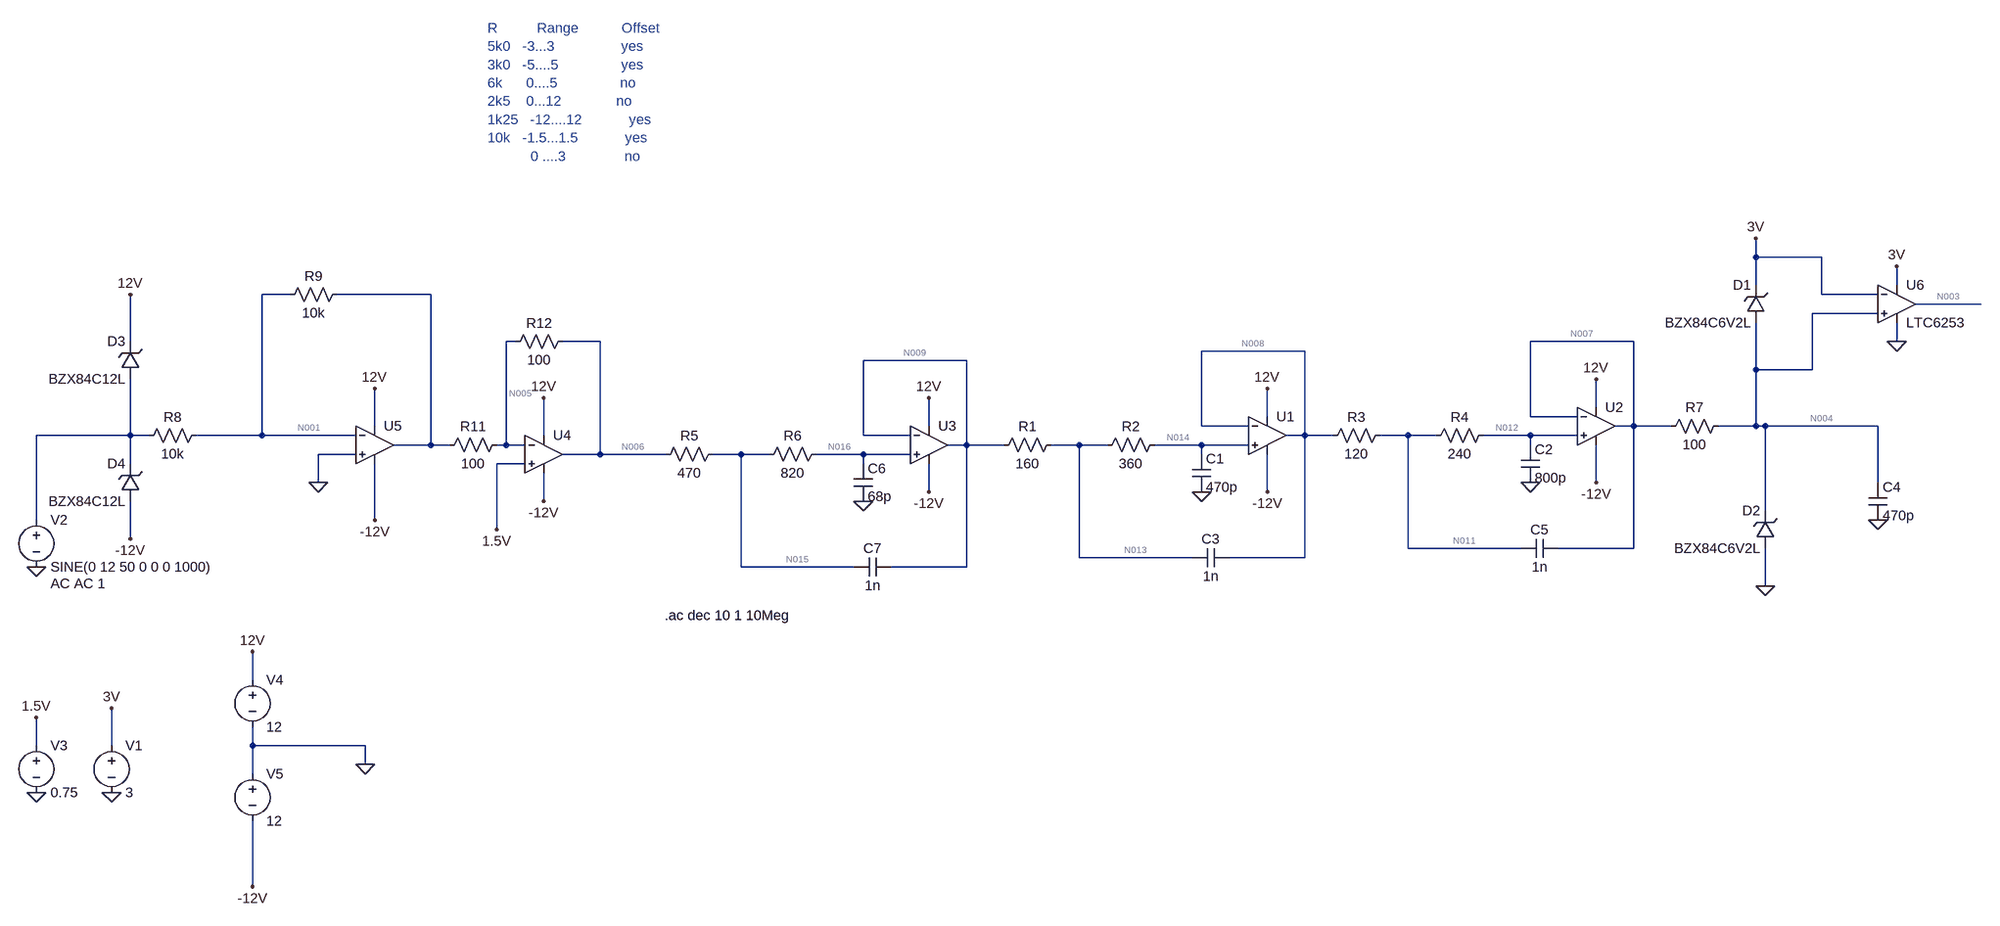
[diagram p0: schematic tp_antialiasing.asc]
* tp_antialiasing.asc
XU1 N014 N008 12V -12V N008 level1 Avol=1Meg GBW=10Meg Vos=0 En=0 Enk=0 In=0 Ink=0 Rin=500Meg  ; pins In+ In- V+ V- OUT
R1 N013 N009 160
R2 N014 N013 360
C1 N014 0 470p
C3 N008 N013 1n
V1 3V 0 3
V2 N010 0 SINE(0 12 50 0 0 0 1000) AC AC 1
C4 N004 0 470p
V3 1.5V 0 0.75
XU2 N012 N007 12V -12V N007 level1 Avol=1Meg GBW=10Meg Vos=0 En=0 Enk=0 In=0 Ink=0 Rin=500Meg  ; pins In+ In- V+ V- OUT
R3 N011 N008 120
R4 N012 N011 240
C2 N012 0 800p
C5 N007 N011 1n
XU3 N016 N009 12V -12V N009 level1 Avol=1Meg GBW=10Meg Vos=0 En=0 Enk=0 In=0 Ink=0 Rin=500Meg  ; pins In+ In- V+ V- OUT
R5 N015 N006 470
R6 N016 N015 820
C6 N016 0 68p
C7 N009 N015 1n
XU4 1.5V N005 12V -12V N006 level1 Avol=1Meg GBW=10Meg Vos=0 En=0 Enk=0 In=0 Ink=0 Rin=500Meg  ; pins In+ In- V+ V- OUT
V4 12V 0 12
V5 0 -12V 12
XU5 0 N001 12V -12V N002 level1 Avol=1Meg GBW=10Meg Vos=0 En=0 Enk=0 In=0 Ink=0 Rin=500Meg  ; pins In+ In- V+ V- OUT
R8 N001 N010 10k
R11 N005 N002 100
R12 N006 N005 100
D2 0 N004 BZX84C6V2L
R7 N004 N007 100
D1 N004 3V BZX84C6V2L
R9 N002 N001 10k
D3 N010 12V BZX84C12L
D4 -12V N010 BZX84C12L
* U6: LTC6253 (symbol Opamps\LTC6253 not available, pins judged from their places): In+=N004 In-=3V V+=3V V-=0 OUT=N003
.model D D
.lib standard.dio
.ac dec 10 1 10Meg
* R          Range           Offset
* 5k0   -3...3                 yes
* 3k0   -5....5                yes
* 6k      0....5                no
* 2k5    0...12              no
* 1k25   -12....12            yes
* 10k   -1.5...1.5            yes
*            0 ....3               no
.lib UniversalOpAmp1.lib
.backanno
.end

* Results of the author's LTspice run, read from the files saved beside the schematic
* Operating Point, zero values left out:
*   V(n008) = 1.5 V
*   V(n014) = 1.5 V
*   V(12v) = 12 V
*   V(-12v) = -12 V
*   V(n013) = 1.5 V
*   V(n009) = 1.5 V
*   V(3v) = 3 V
*   V(n004) = 1.505 V
*   V(1.5v) = 750 mV
*   V(n007) = 1.5 V
*   V(n012) = 1.5 V
*   V(n011) = 1.5 V
*   V(n016) = 1.5 V
*   V(n015) = 1.5 V
*   V(n006) = 1.5 V
*   V(n005) = 750 mV
*   V(n003) = 24.96 mV
*   I(D4) = -996.2 µA
*   I(D3) = -996.2 µA
*   I(D1) = -1.501 nA
*   I(D2) = -1.502 nA
*   I(R7) = 46.58 µA
*   I(R12) = 7.5 mA
*   I(R11) = 7.5 mA
*   I(R6) = -3 nA
*   I(R5) = -3 nA
*   I(R4) = -3 nA
*   I(R3) = -3.001 nA
*   I(R2) = -3 nA
*   I(R1) = -3 nA
*   I(V5) = -996.3 µA
*   I(V4) = -996.3 µA
*   I(V3) = -1.5 nA
*   I(V1) = -3.172 mA
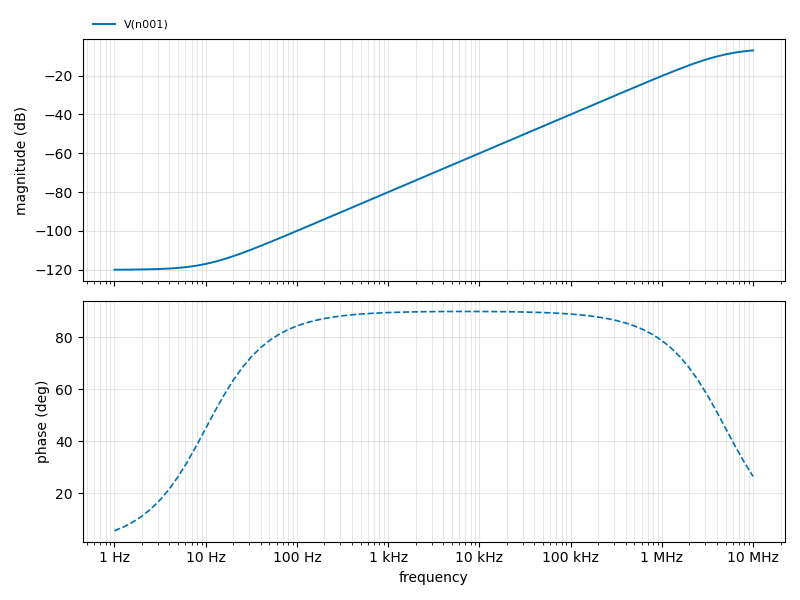
[diagram p1: AC Analysis of tp_antialiasing.asc, plotted from the saved traces]
* AC Analysis, 1 run:
*   V(n001): -119.95 dB at 1 Hz, -6.99 dB at 10 MHz, peak -6.99 dB at 10 MHz, 3 dB below the peak at 4.092 MHz